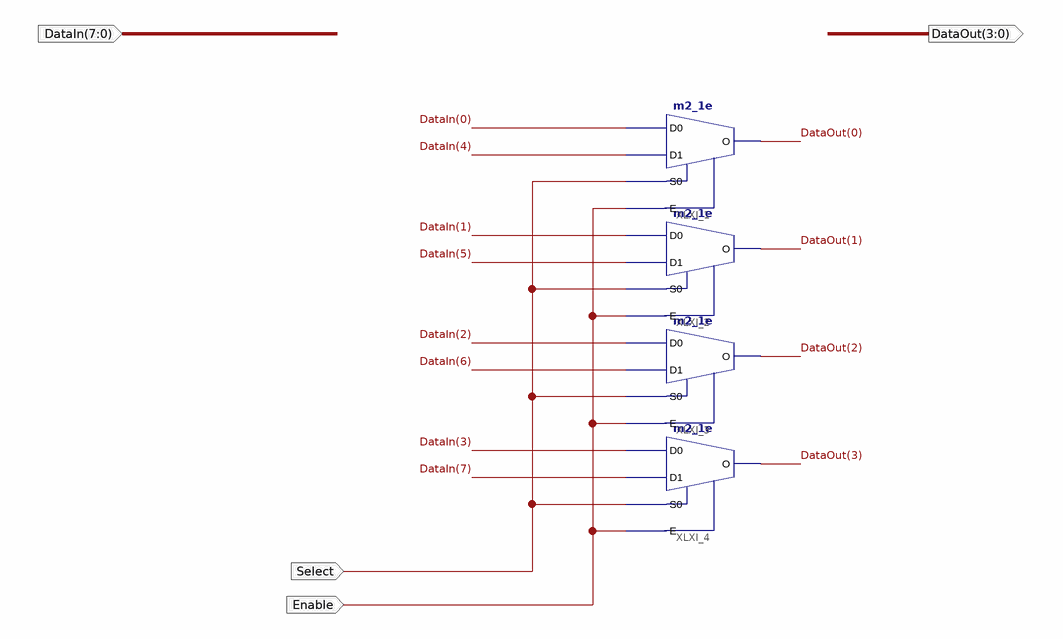
[diagram p0: schematic sheet 1]
// Xilinx ISE schematic MyMux.sch (spartan6) as structural Verilog: 4 symbols, 4 ports
module MyMux (
  input  [7:0] DataIn,
  input  Enable,
  input  Select,
  output [3:0] DataOut
);

  m2_1e XLXI_1 (.D0(DataIn[0]), .D1(DataIn[4]), .E(Enable), .S0(Select), .O(DataOut[0]));
  m2_1e XLXI_2 (.D0(DataIn[1]), .D1(DataIn[5]), .E(Enable), .S0(Select), .O(DataOut[1]));
  m2_1e XLXI_3 (.D0(DataIn[2]), .D1(DataIn[6]), .E(Enable), .S0(Select), .O(DataOut[2]));
  m2_1e XLXI_4 (.D0(DataIn[3]), .D1(DataIn[7]), .E(Enable), .S0(Select), .O(DataOut[3]));
endmodule
